# EAGLE design fp_usb (EAGLE 9.4.2)
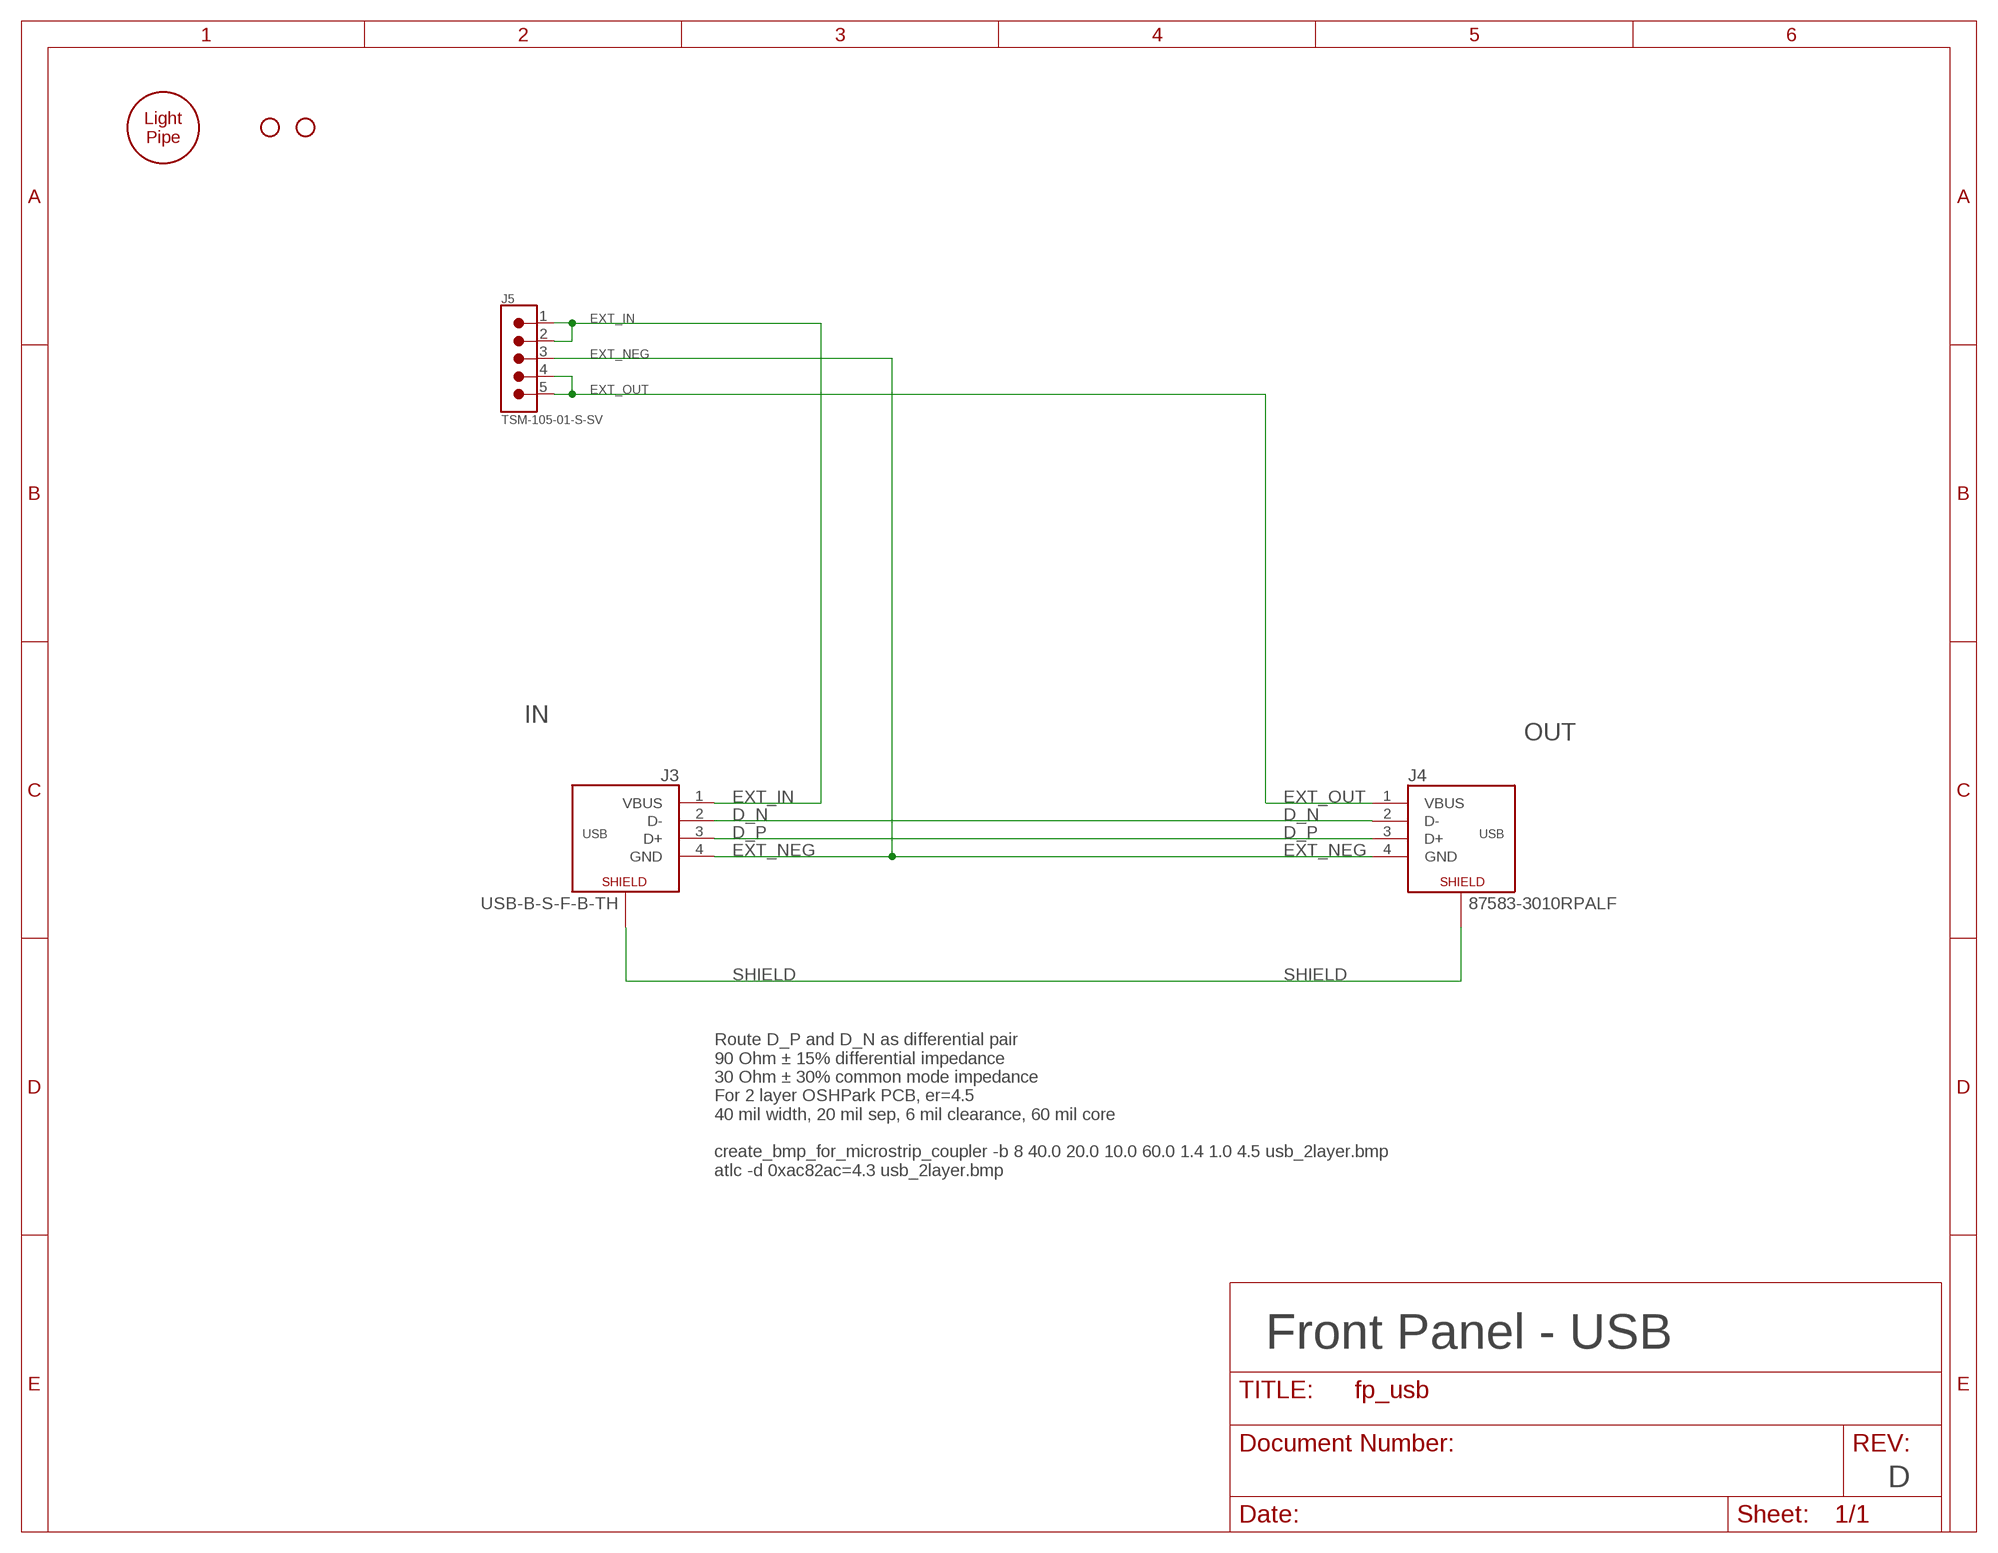
[diagram p0: schematic, sheet 1]

## Parts
H1  51513020125F  LIGHT_PIPE_PANEL_3MM  [LP_3MM]
H3  HOLE_#6  [HOLE_3.5MM]
H4  HOLE_#6  [HOLE_3.5MM]
J3  USB-B-S-F-B-TH  USB-4_B-TH  [USB-B-TH]
J4  87583-3010RPALF  USB-4-A_RCPT  [USB-A_RPCT]
J5  TSM-105-01-S-SV  CONN_0.1_5X1_MS  [CONN_0.1_5X1_MS]

## Nets
D_N [USBD]: J3.2(D-) J4.2(D-)
D_P [USBD]: J3.3(D+) J4.3(D+)
EXT_IN: J3.1(VBUS) J5.1 J5.2
EXT_NEG: J3.4(GND) J4.4(GND) J5.3
EXT_OUT: J4.1(VBUS) J5.4 J5.5
SHIELD: J3.SHIELD@1(SHIELD) J3.SHIELD@2(SHIELD) J4.SHIELD@1(SHIELD) J4.SHIELD@2(SHIELD)

## Notes on the sheet
- IN
- OUT
- Route D_P and D_N as differential pair
  90 Ohm ± 15% differential impedance
  30 Ohm ± 30% common mode impedance
  For 2 layer OSHPark PCB, er=4.5
  40 mil width, 20 mil sep, 6 mil clearance, 60 mil core
  
  create_bmp_for_microstrip_coupler -b 8 40.0 20.0 10.0 60.0 1.4 1.0 4.5 usb_2layer.bmp
  atlc -d 0xac82ac=4.3 usb_2layer.bmp
- Front Panel - USB
- D

## Library data of the parts
H1 = jetperch:LIGHT_PIPE; MPN: 51513020125F; POPULATE: 1
H3 H4 = jetperch:HOLE; POPULATE: 0
J3 = jetperch:USB-4: USB 2 4-pin connectors Use 5-pin connectors for OTG support USB-A-RCPT for Amphenol FCI 87583-3010RPALF USB-B for TE Connectivity 1-1734346-1; MPN: USB-B-S-F-B-TH; POPULATE: 1
J4 = jetperch:USB-4: USB 2 4-pin connectors Use 5-pin connectors for OTG support USB-A-RCPT for Amphenol FCI 87583-3010RPALF USB-B for TE Connectivity 1-1734346-1; MPN: 87583-3010RPALF; POPULATE: 1
J5 = jetperch:CONN_0.1_5X1; MPN: TSM-105-01-S-SV; POPULATE: 1

## Net classes
1 USBD: width 1.016 mm, clearance 0.152 mm to class 0, clearance 0.508 mm

## Board
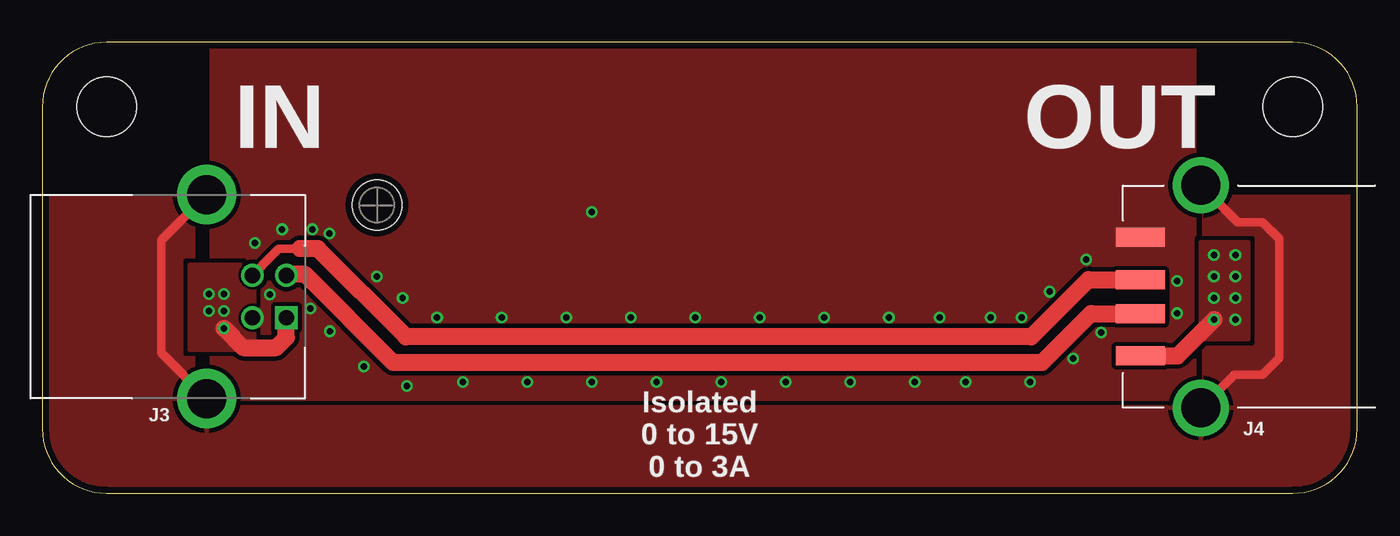
[diagram p1: board, top side]
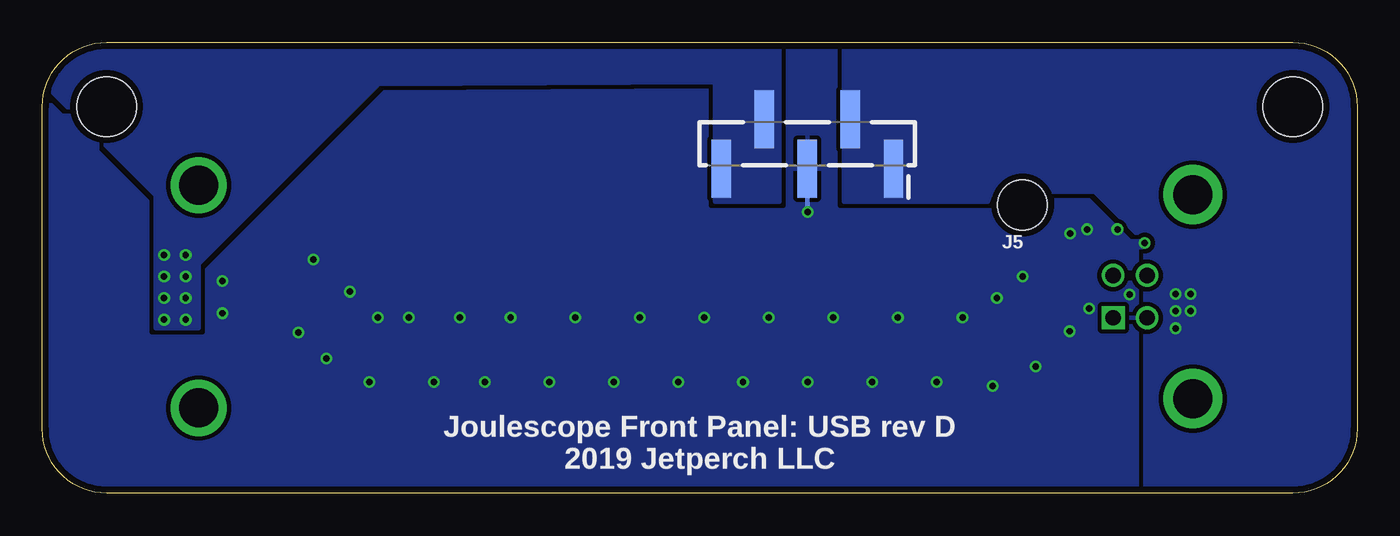
[diagram p2: board, bottom side, seen from below]

Size 77.6 x 26.6 mm. Coordinates in mm from the lower left corner, seen from the top.
Outline: 0,22.81 0,3.79 arc90 3.79,0 73.81,0 arc90 77.6,3.79 77.6,22.81 arc90 73.81,26.6 3.79,26.6 arc90 0,22.81
Copper layers (1*16): Top 0.035mm / dielectric 62mil / Bottom 0.035mm
Design rules "jetperch_2layer *": minimum track width 6mil, minimum drill 15mil, track to track 6mil, track to pad 6mil, pad to pad 6mil, via to via 6mil, smd to smd 0mil, copper to edge 15mil, drill to drill 15mil, minimum pad ring 6mil, minimum via ring 6mil, stop-mask expansion 2mil, vias tented up to drill 15mil, thermal gap 10mil
bKeepout: area -0.2,17.3 to 25.3,19.3; area 39.3,17.3 to 77.4,19.3; area 0,0 to 77.6,1.5; area 0,25.1 to 77.6,26.6; area 0,0 to 1.5,26.6; area 76.1,0 to 77.6,26.6

### Footprints (pad centres in the part's own frame; a part is rotated, then mirrored left to right if it is on the bottom)
LP_3MM = hole 2.921: 0,0
HOLE_3.5MM = hole 3.5: 0,0
USB-B-TH = drill 0.9 square: 1 -1.25,-15.1 | drill 0.9: 2 1.25,-15.1; 3 1.25,-13.1; 4 -1.25,-13.1 | drill 2.3 pad 3.5: SHIELD@1 -6.02,-10.4; SHIELD@2 6.02,-10.4
USB-A_RPCT = smd 1.12 x 2.88: 1 -3.5,3.58; 2 -1,3.58; 3 1,3.58; 4 3.5,3.58 | drill 2.3: SHIELD@1 -6.57,0; SHIELD@2 6.57,0
CONN_0.1_5X1_MS = smd 1.143 x 3.429: 1 -5.08,1.46; 2 -2.54,-1.46; 3 0,1.46; 4 2.54,-1.46; 5 5.08,1.46

### Placement (x,y rotation side)
H1  19.75,17 0 top
H3  3.79,22.81 0 top
H4  73.81,22.81 0 top
J3  -0.7,11.6 90 top
J4  68.38,11.6 90 top
J5  32.45,20.61 180 bottom

### Tracks (layer width: path | path; a pad name or v marks a point on that pad's centre or on a via)
D_N
  Top 1.016: J3.2 14.46,12.9 15.5,12.9 20.71,7.7 59,7.7 61.9,10.6 J4.2
D_P
  Top 0.508: J3.3 12.96,13.41 12.96,13.45 13.95,14.43 15.21,14.43
  Top 1.016: 15.21,14.43 16.26,14.43 21.47,9.22 58.36,9.22 61.74,12.6 63.46,12.6 63.5,12.56 63.54,12.6 J4.3
EXT_IN  (via drill 0.38)
  Top 1.016: v10.72,9.73 11.87,8.59 13.81,8.59 14.4,9.18 J3.1
  other vias: 10.72,10.75 10.72,11.76 9.83,11.76 9.83,10.75
  pour Bottom (isolate 0.254, no thermals): 30.28,26.6 30.28,17.21 21.8,17.21 21.59,17.78 15.47,17.78 12.5,14.81 12.5,0 3.79,0 arc-90 0,3.79 0,22.81 arc-90 3.79,26.6
  pour Top: 8.69,13.47 12.5,13.47 12.5,8.46 8.69,8.46
EXT_NEG  (via drill 0.38)
  Bottom 0.254: J5.3 v32.45,16.6 v32.44,16.59
  other vias: 19.74,12.78 21.26,11.51 23.3,10.37 15.82,10.89 18.98,7.48 21.52,6.32 24.82,6.55 28.63,6.55 32.44,6.55 36.25,6.55 40.06,6.55 43.87,6.55 47.68,6.55 51.49,6.55 58.3,6.55 60.84,7.95 62.49,9.48 61.6,13.79 57.79,10.37 59.44,11.89 27.11,10.37 30.91,10.37 34.73,10.37 38.53,10.37 42.34,10.37 46.16,10.37 49.97,10.37 14.15,15.57 15.93,15.57 66.98,12.52 66.98,10.62 13.42,11.72 12.53,14.76 16.98,9.56 16.95,15.32 52.97,10.37 54.49,6.55 55.97,10.37
  pour Top (isolate 0.254, rank 3, no thermals): 68,0 10,0 10,26.6 68,26.6
  pour Bottom (isolate 0.254, rank 2): 3.79,26.6 73.81,26.6 arc-90 77.6,22.81 77.6,3.79 arc-90 73.81,0 3.79,0 arc-90 0,3.79 0,22.81 arc-90
  cutout Top: 66.4,13 66.4,10.2 61,10.2 61,12 62,13
EXT_OUT  (via drill 0.38)
  Top 1: J4.1 67,8.1 v69.14,10.24
  other vias: 69.14,11.51 69.14,12.78 70.41,12.78 70.41,11.51 70.41,10.24 70.41,14.05 69.14,14.05
  pour Top (isolate 0.254): 68.38,14.81 68.38,9.1 71.17,9.1 71.17,14.81
  pour Bottom (isolate 0.254, no thermals): 34.09,17.2 37.9,17.2 37.9,24.26 57.78,24.14 68.38,13.54 68.38,9.73 70.92,9.73 70.92,17.58 77.47,24.13 arc90 75,26.6 34.09,26.6
SHIELD
  Top 0.5: J3.SHIELD@2 7,14.92 7,8.28 J3.SHIELD@1 | J4.SHIELD@2 70.55,16 72,16 73,15 73,8 72,7 70.35,7 J4.SHIELD@1
  pour Top (isolate 0.254, rank 2): 8.89,17.5 0,17.5 0,0 77.6,0 77.6,17.5 68.58,17.5 68.58,5.08 8.89,5.08

### Text on the board
_tsilk: IN | OUT | Isolated / 0 to 15V / 0 to 3A
_bsilk: Joulescope Front Panel: USB rev D / 2019 Jetperch LLC